# Altium project AKK_V3.PrjPcb
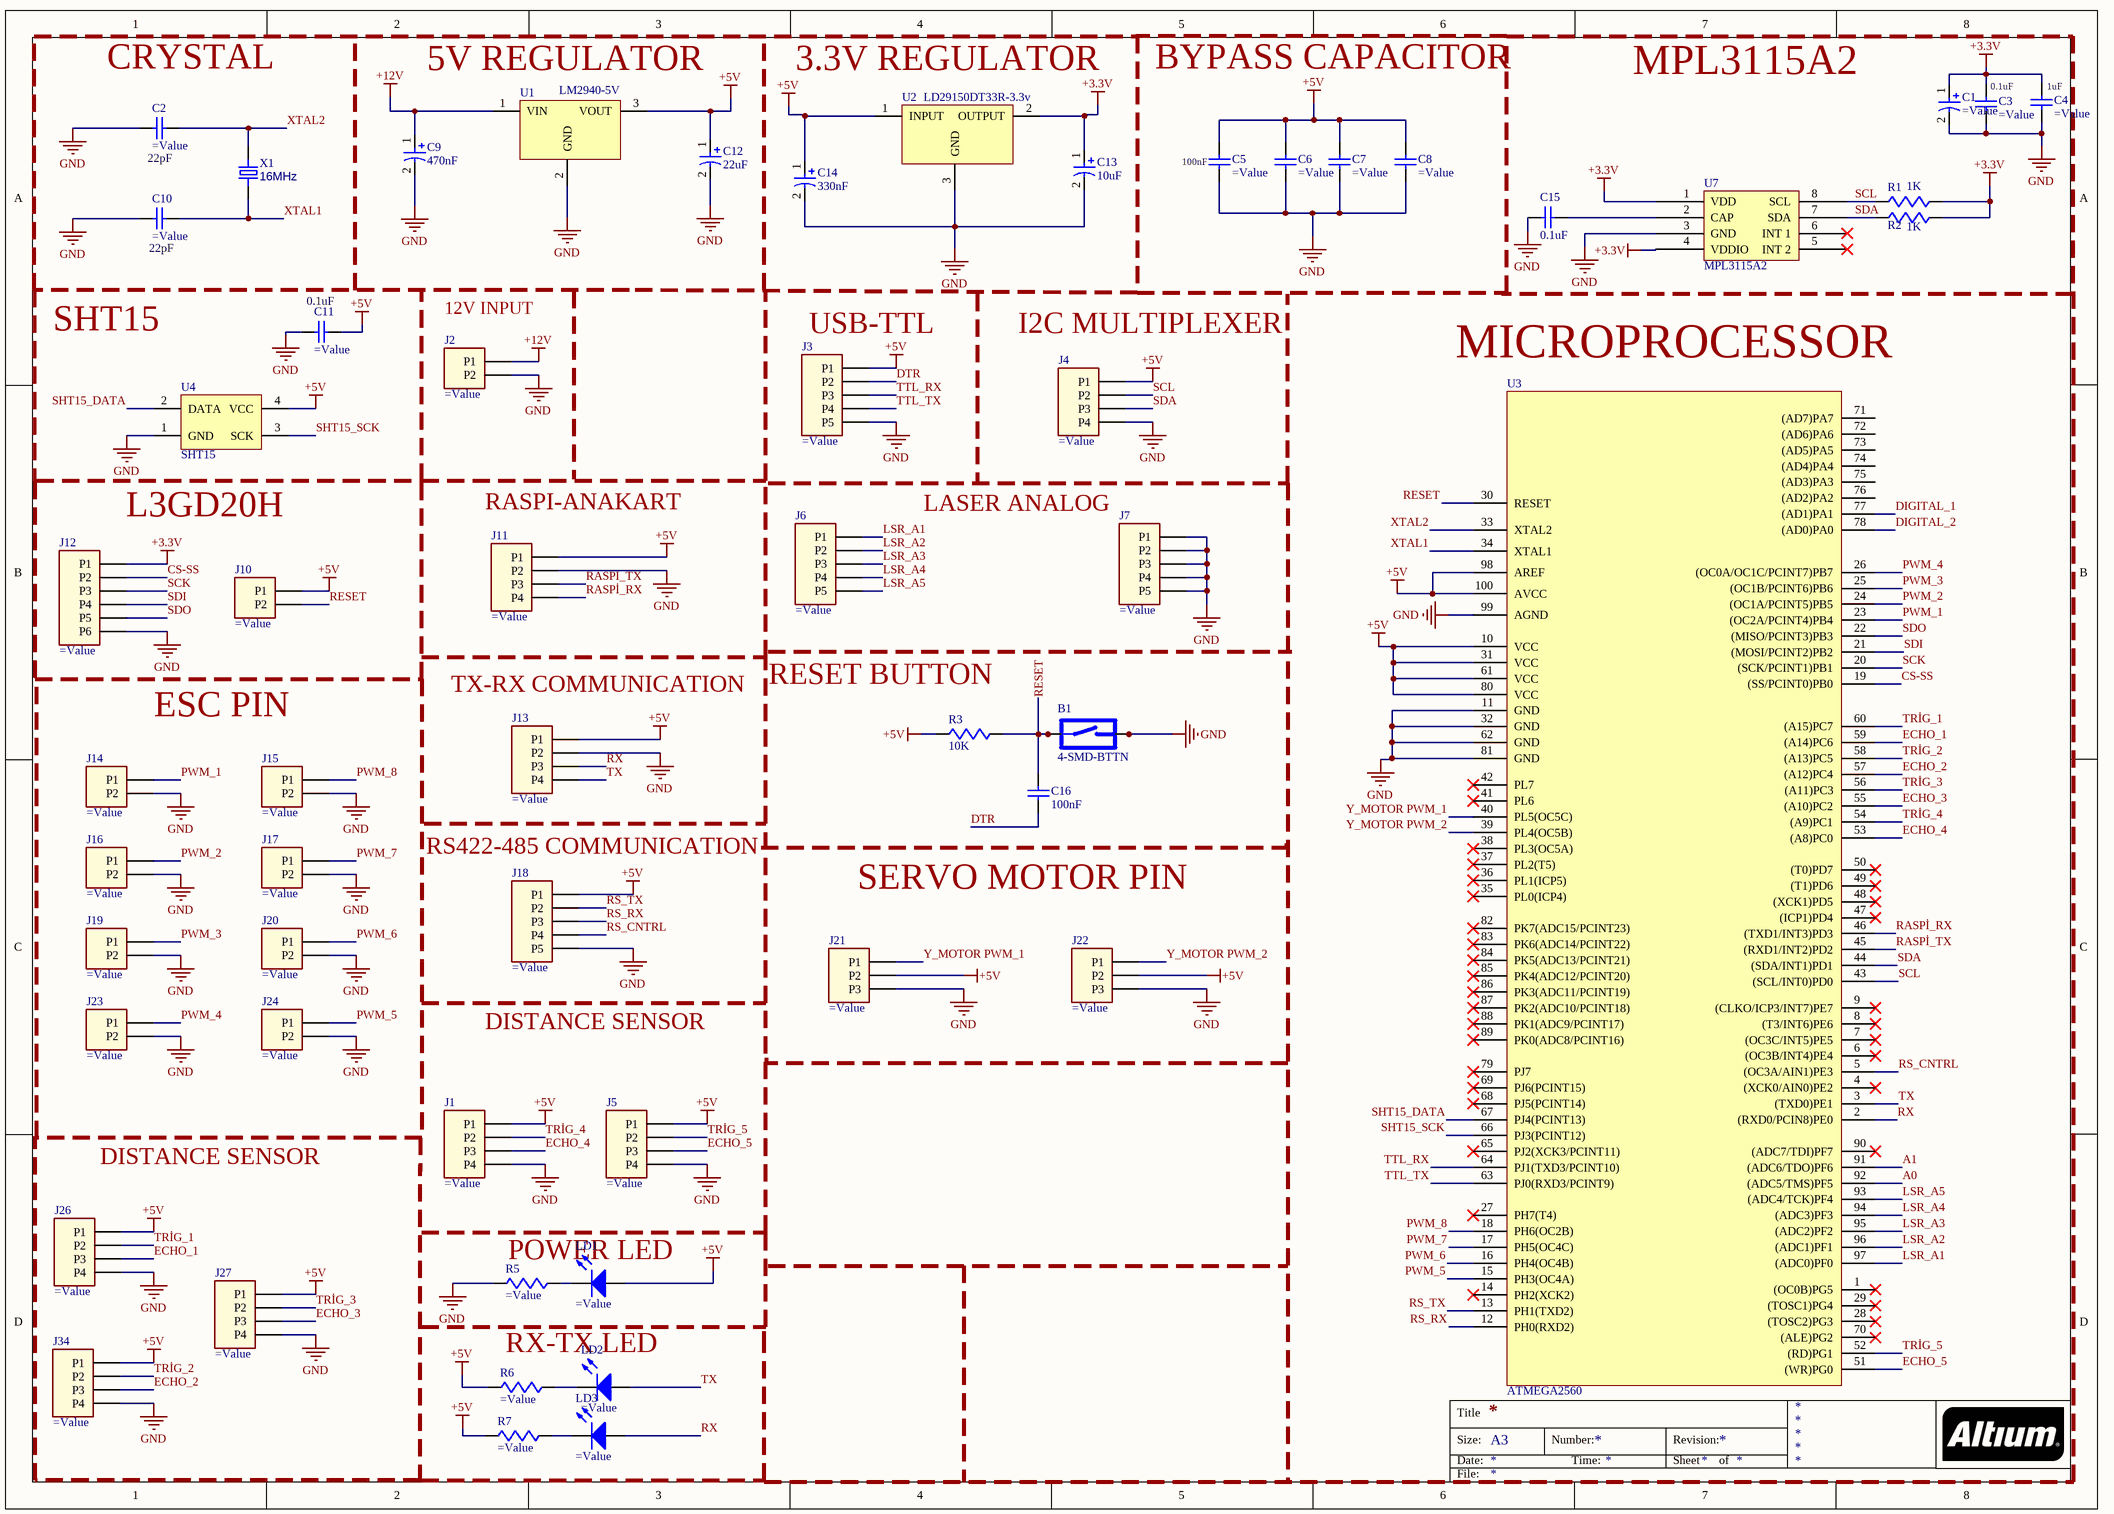
[diagram p0: AKK_V3.SchDoc]
1 sheet, 57 parts. Net scope: global (net labels, ports and power ports of the same name join across sheets).
Board file: AKK_V2.1.PcbDoc

## Sheet AKK_V3.SchDoc
size A3

### Parts
B1  4-SMD-BTTN  [4-SMD-BTTN-11.6-6.5]
C1  (no value)  [CAP_5MM]
C2  (no value)  [C1206N]
C3  (no value)  [C1206N]
C4  (no value)  [C1206N]
C5  (no value)  [C1206N]
C6  (no value)  [C1206N]
C7  (no value)  [C1206N]
C8  (no value)  [C1206N]
C9  470nF  [T_1206]
C10  (no value)  [C1206N]
C11  (no value)  [C1206N]
C12  22uF  [T_7343]
C13  10uF  [T_7343]
C14  330nF  [T_1206]
C15  0.1uF  [C1206N]
C16  100nF  [C1206N]
J1  (no value)  [4_PİN_HEADER]
J2  (no value)  [Klemens_5mm]
J3  (no value)  [5_PİN_HEADER]
J4  (no value)  [4_PİN_HEADER]
J5  (no value)  [4_PİN_HEADER]
J6  (no value)  [5_PİN_HEADER]
J7  (no value)  [5_PİN_HEADER]
J10  (no value)  [2_PİN_HEADER]
J11  (no value)  [4_PİN_HEADER]
J12  (no value)  [CONN_6_XH]
J13  (no value)  [4_PİN_HEADER]
J14  (no value)  [CONN_2_XH]
J15  (no value)  [CONN_2_XH]
J16  (no value)  [CONN_2_XH]
J17  (no value)  [CONN_2_XH]
J18  (no value)  [5_PİN_HEADER]
J19  (no value)  [CONN_2_XH]
J20  (no value)  [CONN_2_XH]
J21  (no value)  [CONN_3_XH]
J22  (no value)  [CONN_3_XH]
J23  (no value)  [CONN_2_XH]
J24  (no value)  [CONN_2_XH]
J26  (no value)  [4_PİN_HEADER]
J27  (no value)  [4_PİN_HEADER]
J34  (no value)  [4_PİN_HEADER]
LD1  (no value)  [1206-BLUE]
LD2  (no value)  [1206-BLUE]
LD3  (no value)  [1206-BLUE]
R1  1K  [R1206N]
R2  1K  [R1206N]
R3  10K  [R1206N]
R5  (no value)  [R1206N]
R6  (no value)  [R1206N]
R7  (no value)  [R1206N]
U1  LM2940-5V  [TO220]
U2  LD29150DT33R-3.3v  [TO252-DPAK]
U3  ATMEGA2560  [TQFP100-2]
U4  SHT15  [SHT15]
U7  MPL3115A2  [MPL3115A2]
X1  16MHz  [HC49]

### Nets
+3.3V: C1.1(P) C3.2 C4.2 C13.1(P) J12.1(P1) R1.2(B) R2.2(B) U2.2(OUTPUT) U7.1(VDD) U7.4(VDDIO)
+5V: C5.2 C6.2 C7.2 C8.2 C11.1 C12.1(P) C14.1(P) J1.1(P1) J3.1(P1) J4.1(P1) J5.1(P1) J10.1(P1) J11.1(P1) J13.1(P1) J18.1(P1) J21.2(P2) J22.2(P2) J26.1(P1) J27.1(P1) J34.1(P1) LD1.2(A) R3.1(A) R6.1(A) R7.1(A) U1.3(VOUT) U2.1(INPUT) U3.10(VCC) U3.31(VCC) U3.61(VCC) U3.80(VCC) U3.98(AREF) U3.100(AVCC) U4.4(VCC)
+12V: C9.1(P) J2.1(P1) U1.1(VIN)
GND: B1.1 B1.2 C1.2(N) C2.2 C3.1 C4.1 C5.1 C6.1 C7.1 C8.1 C9.2(N) C10.2 C11.2 C12.2(N) C13.2(N) C14.2(N) C15.2 J1.4(P4) J2.2(P2) J3.5(P5) J4.4(P4) J5.4(P4) J7.1(P1) J7.2(P2) J7.3(P3) J7.4(P4) J7.5(P5) J11.2(P2) J12.6(P6) J13.2(P2) J14.2(P2) J15.2(P2) J16.2(P2) J17.2(P2) J18.5(P5) J19.2(P2) J20.2(P2) J21.3(P3) J22.3(P3) J23.2(P2) J24.2(P2) J26.4(P4) J27.4(P4) J34.4(P4) R5.1(A) U1.2(GND) U2.3(GND) U3.11(GND) U3.32(GND) U3.62(GND) U3.81(GND) U3.99(AGND) U4.1(GND) U7.3(GND)
A0: U3.92((ADC5/TMS)PF5)
A1: U3.91((ADC6/TDO)PF6)
CS-SS: J12.2(P2) U3.19((SS/PCINT0)PB0)
DIGITAL_1: U3.77((AD1)PA1)
DIGITAL_2: U3.78((AD0)PA0)
DTR: C16.1 J3.2(P2)
ECHO_1: J26.3(P3) U3.59((A14)PC6)
ECHO_2: J34.3(P3) U3.57((A12)PC4)
ECHO_3: J27.3(P3) U3.55((A10)PC2)
ECHO_4: J1.3(P3) U3.53((A8)PC0)
ECHO_5: J5.3(P3) U3.51((WR)PG0)
LSR_A1: J6.1(P1) U3.97((ADC0)PF0)
LSR_A2: J6.2(P2) U3.96((ADC1)PF1)
LSR_A3: J6.3(P3) U3.95((ADC2)PF2)
LSR_A4: J6.4(P4) U3.94((ADC3)PF3)
LSR_A5: J6.5(P5) U3.93((ADC4/TCK)PF4)
PWM_1: J14.1(P1) U3.23((OC2A/PCINT4)PB4)
PWM_2: J16.1(P1) U3.24((OC1A/PCINT5)PB5)
PWM_3: J19.1(P1) U3.25((OC1B/PCINT6)PB6)
PWM_4: J23.1(P1) U3.26((OC0A/OC1C/PCINT7)PB7)
PWM_5: J24.1(P1) U3.15(PH3(OC4A))
PWM_6: J20.1(P1) U3.16(PH4(OC4B))
PWM_7: J17.1(P1) U3.17(PH5(OC4C))
PWM_8: J15.1(P1) U3.18(PH6(OC2B))
RASPİ_RX: J11.4(P4) U3.46((TXD1/INT3)PD3)
RASPİ_TX: J11.3(P3) U3.45((RXD1/INT2)PD2)
RESET: B1.3 B1.4 C16.2 J10.2(P2) R3.2(B) U3.30(RESET)
RS_CNTRL: J18.4(P4) U3.5((OC3A/AIN1)PE3)
RS_RX: J18.3(P3) U3.12(PH0(RXD2))
RS_TX: J18.2(P2) U3.13(PH1(TXD2))
RX: J13.3(P3) LD3.2(A) U3.2((RXD0/PCIN8)PE0)
SCK: J12.3(P3) U3.20((SCK/PCINT1)PB1)
SCL: J4.2(P2) R1.1(A) U3.43((SCL/INT0)PD0) U7.8(SCL)
SDA: J4.3(P3) R2.1(A) U3.44((SDA/INT1)PD1) U7.7(SDA)
SDI: J12.4(P4) U3.21((MOSI/PCINT2)PB2)
SDO: J12.5(P5) U3.22((MISO/PCINT3)PB3)
SHT15_DATA: U3.67(PJ4(PCINT13)) U4.2(DATA)
SHT15_SCK: U3.66(PJ3(PCINT12)) U4.3(SCK)
TRİG_1: J26.2(P2) U3.60((A15)PC7)
TRİG_2: J34.2(P2) U3.58((A13)PC5)
TRİG_3: J27.2(P2) U3.56((A11)PC3)
TRİG_4: J1.2(P2) U3.54((A9)PC1)
TRİG_5: J5.2(P2) U3.52((RD)PG1)
TTL_RX: J3.3(P3) U3.64(PJ1(TXD3/PCINT10))
TTL_TX: J3.4(P4) U3.63(PJ0(RXD3/PCINT9))
TX: J13.4(P4) LD2.2(A) U3.3((TXD0)PE1)
XTAL1: C10.1 U3.34(XTAL1) X1.1
XTAL2: C2.1 U3.33(XTAL2) X1.2
Y_MOTOR PWM_1: J21.1(P1) U3.40(PL5(OC5C))
Y_MOTOR PWM_2: J22.1(P1) U3.39(PL4(OC5B))
NetC15_1: C15.1 U7.2(CAP)
NetLD1_1: LD1.1(K) R5.2(B)
NetLD2_1: LD2.1(K) R6.2(B)
NetLD3_1: LD3.1(K) R7.2(B)

Not connected (* = marked no-connect by the designer): U3 1((OC0B)PG5)* 4((XCK0/AIN0)PE2)* 6((OC3B/INT4)PE4)* 7((OC3C/INT5)PE5)* 8((T3/INT6)PE6)* 9((CLKO/ICP3/INT7)PE7)* 14(PH2(XCK2))* 27(PH7(T4))* 28((TOSC2)PG3)* 29((TOSC1)PG4)* 35(PL0(ICP4))* 36(PL1(ICP5))* 37(PL2(T5))* 38(PL3(OC5A))* 41(PL6)* 42(PL7)* 47((ICP1)PD4)* 48((XCK1)PD5)* 49((T1)PD6)* 50((T0)PD7)* 65(PJ2(XCK3/PCINT11))* 68(PJ5(PCINT14))* 69(PJ6(PCINT15))* 70((ALE)PG2)* 71((AD7)PA7) 72((AD6)PA6) 73((AD5)PA5) 74((AD4)PA4) 75((AD3)PA3) 76((AD2)PA2) 79(PJ7)* 82(PK7(ADC15/PCINT23))* 83(PK6(ADC14/PCINT22))* 84(PK5(ADC13/PCINT21))* 85(PK4(ADC12/PCINT20))* 86(PK3(ADC11/PCINT19))* 87(PK2(ADC10/PCINT18))* 88(PK1(ADC9/PCINT17))* 89(PK0(ADC8/PCINT16))* 90((ADC7/TDI)PF7)*; U7 5(INT_2)* 6(INT_1)*

### Notes on the sheet
- (near C2) CRYSTAL
- (near U1) 5V REGULATOR
- (near U2) 3.3V REGULATOR
- BYPASS CAPACITOR
- MPL3115A2
- (near C3) 0.1uF
- (near C4) 1uF
- (near C2) 22pF
- (near C5) 100nF
- (near C10) 22pF
- (near C11) 0.1uF
- (near J2) 12V INPUT
- SHT15
- (near J3) USB-TTL
- (near J4) I2C MULTIPLEXER
- MICROPROCESSOR
- L3GD20H
- (near J11) RASPI-ANAKART
- LASER ANALOG
- ESC PIN
- (near J13) TX-RX COMMUNICATION
- (near R3) RESET BUTTON
- RS422-485 COMMUNICATION
- SERVO MOTOR PIN
- DISTANCE SENSOR
- POWER LED
- RX-TX LED
- Title
- Size:
- Date:
- A3
- Number:
- Time:
- Revision:
- Sheet
- of
- File:

### Library data of the parts
B1 = B3FS-1012P: SWITCH TACTILE SPST-NO 0.05A 24V; Manufacturer: Omron; Mechanical Life: 300000Cycles; Switch Travel: 0.25mm; Actuator Type: Standard; Switch Function: Off-Mom; Illumination Type: Non-Illuminated; Throw Configuration: SPST; Contact Resistance: 100mR; Operating Force: 1.47N; Current Rating: 50mA; Actuator Length: 1.7mm; Manufacturer Part Number: B3FS-1012P; Supplier 1: Avnet; Supplier Part Number 1: B3FS-1012P; RoHS: Yes; Category: Tactile Switches; Stock 1: 221000; Pricing 1: 1000=0,33775, 2000=0,33710, 4000=0,33643, 6000=0,32612, 8000=0,30625 (USD); Mount: Surface Mount; Case/Package: SMD/SMT; Weight: 0.2g; Contact Plating: Silver; Min Operating Temperature: -20°C; Max Operating Temperature: 70°C; Termination: Gull Wing; Electrical Life: 300000Cycles; Voltage Rating (DC): 24V; Packaging: Tape and Reel; Max Voltage Rating (DC): 24V; Package Quantity: 1; Max Current Rating: 50mA; Orientation: Straight; Length: 6.3mm; Depth: 8mm; Radiation Hardening: No; ComponentLink1URL: https://datasheet.ciiva.com/30089/en-b3fs-30089264.pdf?src-supplier=Onlinecomponents.com; ComponentLink1Description: https://datasheet.ciiva.com/30089/en-b3fs-30089264.pdf?src-supplier=Onlinecomponents.com; ComponentLink2URL: https://datasheet.ciiva.com/2901/1200910001-jpg-2901308.pdf?src-supplier=Digi-Key; ComponentLink2Description: https://datasheet.ciiva.com/2901/1200910001-jpg-2901308.pdf?src-supplier=Digi-Key; ComponentLink3URL: https://datasheet.ciiva.com/2901/en-b3fs-2901309.pdf?src-supplier=Digi-Key; ComponentLink3Description: https://datasheet.ciiva.com/2901/en-b3fs-2901309.pdf?src-supplier=Digi-Key; ComponentLink4URL: https://datasheet.ciiva.com/2901/en-b3fs-2901310.pdf?src-supplier=Digi-Key; ComponentLink4Description: https://datasheet.ciiva.com/2901/en-b3fs-2901310.pdf?src-supplier=Digi-Key
C1 = EEE-1CA100SR: Capacitor; Alum Electrolytic; Cap 10 uF; Tol 20%; Vol-Rtg 16 VDC; SMT; 4x5.5; Cut Tape; Manufacturer: Panasonic; Capacitance: 10uF; Voltage Rating: 16V; Dielectric Material: Aluminium; Life (Hours): 2000Hour; Polarity: Polar; Leakage Current: 3uA; Ripple Current: 28mA; Lead Length: 1.8mm; Manufacturer Part Number: EEE-1CA100SR; Supplier 1: Arrow; Supplier Part Number 1: EEE-1CA100SR; RoHS: Yes; Category: Aluminum Electrolytic Capacitors; Stock 1: 148000; Pricing 1: 2000=0,05160, 4000=0,05110, 10000=0,04690, 1=0,22540, 10=0,18810 (USD); Mount: Surface Mount,PCB; Case/Package: Radial; Number of Pins: 2; Min Operating Temperature: -40°C; Max Operating Temperature: 85°C; Packaging: Tape and Reel; Voltage Rating (DC): 16V; Package Quantity: 2000; Termination: SMD/SMT; Voltage: 16V; Length: 5.5mm; Height: 5.4mm; Width: 4.3mm; Radiation Hardening: No; Lead Free: Lead Free; REACH SVHC: No SVHC; ComponentLink1URL: https://datasheet.ciiva.com/11784/0900766b8078636e-11784608.pdf?src-supplier=RSComponents; ComponentLink1Description: https://datasheet.ciiva.com/11784/0900766b8078636e-11784608.pdf?src-supplier=RSComponents; ComponentLink2URL: https://datasheet.ciiva.com/19458/1355487-19458346.pdf?src-supplier=Jameco; ComponentLink2Description: https://datasheet.ciiva.com/19458/1355487-19458346.pdf?src-supplier=Jameco; ComponentLink3URL: https://datasheet.ciiva.com/2983/aba0000ce2-2983908.pdf?src-supplier=Avnet; ComponentLink3Description: https://datasheet.ciiva.com/2983/aba0000ce2-2983908.pdf?src-supplier=Avnet; ComponentLink4URL: https://datasheet.ciiva.com/46435/aba0000ce2-46435189.pdf?src-supplier=Element14; ComponentLink6URL: https://datasheet.ciiva.com/43485/aba0000ce2-43485607.pdf?src-supplier=Farnell; ComponentLink6Description: https://datasheet.ciiva.com/43485/aba0000ce2-43485607.pdf?src-supplier=Farnell; ComponentLink7URL: https://datasheet.ciiva.com/14603/70255710-14603768.pdf?src-supplier=Allied+Electronics; Contact Plating: Tin; Tolerance: 20%; Height - Seated (Max): 0.213inch; Ripple Current (AC): 28mA; Diameter: 4mm; Lead Pitch: 1mm; ComponentLink8URL: https://datasheet.ciiva.com/17353/aba0000ce2-17353304.pdf?src-supplier=Avnet+Europe; ComponentLink8Description: https://datasheet.ciiva.com/17353/aba0000ce2-17353304.pdf?src-supplier=Avnet+Europe; ComponentLink9URL: https://datasheet.ciiva.com/14589/70255710-14589897.pdf?src-supplier=Allied+Electronics; ComponentLink9Description: https://datasheet.ciiva.com/14589/70255710-14589897.pdf?src-supplier=Allied+Electronics
C2-C8 C10 C11 C15 = C1206C104K5RAC7210: CAP CER 0.1UF 50V X7R 1206; Manufacturer: KEMET; Capacitance: 100nF; Tolerance: 10%; Dielectric Material: Ceramic; Manufacturer Part Number: C1206C104K5RAC7210; Supplier 1: Digi-Key; Supplier Part Number 1: 399-7357-2-ND; RoHS: Yes; Category: Ceramic Capacitors; Stock 1: 70000; Pricing 1: 10000=0,01650, 20000=0,01568 (USD); Mount: Surface Mount; Case/Package: 1206; Case Code (Imperial): 1206; Case Code (Metric): 3216; Min Operating Temperature: -55°C; Max Operating Temperature: 125°C; Dielectric: X7R; Voltage Rating: 50V; Packaging: Tape and Reel; Voltage Rating (DC): 50V; Package Quantity: 10000; Termination: SMD/SMT; Length: 3.2mm; Height: 0.78mm; Width: 1.6mm; Thickness: 0.035inch; Depth: 1.6mm; Radiation Hardening: No; ComponentLink1URL: https://datasheet.ciiva.com/16623/datasheetpn-c1206c104k5rac7210-16623777.pdf?src-supplier=Avnet+Europe; ComponentLink1Description: https://datasheet.ciiva.com/16623/datasheetpn-c1206c104k5rac7210-16623777.pdf?src-supplier=Avnet+Europe; ComponentLink2URL: https://datasheet.ciiva.com/18194/getdatasheetpartid-94372-18194154.pdf?src-supplier=Verical; ComponentLink2Description: https://datasheet.ciiva.com/18194/getdatasheetpartid-94372-18194154.pdf?src-supplier=Verical
C9 C14 = TCJA106M020R0150: CAP TANT POLY 10UF 20V 1206; Manufacturer: Kyocera AVX; Tolerance: 20%; ESR (Equivalent Series Resistance): 150mR; Life (Hours): 2000Hour; Manufacturer Part Number: TCJA106M020R0150; Supplier 1: Future Electronics; Supplier Part Number 1: TCJA106M020R0150-REEL; RoHS: No; Category: Polymer Capacitors; Stock 1: 8000; Pricing 1: 2000=0,29500 (USD); Mount: Surface Mount; Case/Package: 1206; Case Code (Imperial): 1206; Case Code (Metric): 3216; Min Operating Temperature: -55°C; Max Operating Temperature: 105°C; Capacitance: 10uF; Voltage Rating: 20V; Packaging: Tape and Reel; ComponentLink1URL: http://www.farnell.com/datasheets/2708905.pdf?src-supplier=Farnell; ComponentLink1Description: http://www.farnell.com/datasheets/2708905.pdf?src-supplier=Farnell; ComponentLink2URL: http://datasheets.avx.com/TCJ.pdf?src-supplier=Digi-Key; ComponentLink2Description: http://datasheets.avx.com/TCJ.pdf?src-supplier=Digi-Key; ComponentLink3URL: http://catalogs.avx.com/TantalumNiobium.pdf?src-supplier=Digi-Key; ComponentLink3Description: http://catalogs.avx.com/TantalumNiobium.pdf?src-supplier=Digi-Key; Features: General Purpose
C12 C13 = TCJD226M035R0100: CAP TANT POLY 22UF 35V 2917; Manufacturer: Kyocera AVX; Tolerance: 20%; Resistance: 0.1R; ESR (Equivalent Series Resistance): 100mR; Manufacturer Part Number: TCJD226M035R0100; Supplier 1: Arrow; Supplier Part Number 1: TCJD226M035R0100; RoHS: Yes; Category: Tantalum Capacitors; Stock 1: 400; Pricing 1: 1=2,46600, 10=2,37000, 25=2,34600, 100=2,07700, 250=2,06700 (USD); Mount: Surface Mount; Case/Package: 2917; Case Code (Imperial): 2917; Case Code (Metric): 7343; Min Operating Temperature: -55°C; Max Operating Temperature: 125°C; Capacitance: 22uF; Voltage Rating: 35V; Packaging: Tape and Reel; Voltage Rating (DC): 35V; Package Quantity: 1; Termination: SMD/SMT; Length: 7.3mm; Height: 3.1mm; Width: 4.3mm; Depth: 4.3mm; Radiation Hardening: No; Lead Free: Lead Free; ComponentLink1URL: https://datasheet.ciiva.com/265/tcj-265476.pdf?src-supplier=Digi-Key; ComponentLink1Description: https://datasheet.ciiva.com/265/tcj-265476.pdf?src-supplier=Digi-Key; ComponentLink2URL: https://datasheet.ciiva.com/265/tcj-265477.pdf?src-supplier=Digi-Key; ComponentLink2Description: https://datasheet.ciiva.com/265/tcj-265477.pdf?src-supplier=Digi-Key; ComponentLink3URL: https://datasheet.ciiva.com/265/tcj-265478.pdf?src-supplier=Digi-Key; ComponentLink3Description: https://datasheet.ciiva.com/265/tcj-265478.pdf?src-supplier=Digi-Key; Height - Seated (Max): 0.122inch
C16 = C1206C104K5RAC7210: CAP CER 0.1UF 50V X7R 1206; Manufacturer: KEMET; Tolerance: 10%; Dielectric Material: Ceramic; Manufacturer Part Number: C1206C104K5RAC7210; Supplier 1: Digi-Key; Supplier Part Number 1: 399-7357-2-ND; RoHS: Yes; Category: Ceramic Capacitors; Stock 1: 70000; Pricing 1: 10000=0,01650, 20000=0,01568 (USD); Mount: Surface Mount; Case/Package: 1206; Case Code (Imperial): 1206; Case Code (Metric): 3216; Min Operating Temperature: -55°C; Max Operating Temperature: 125°C; Capacitance: 100nF; Dielectric: X7R; Voltage Rating: 50V; Packaging: Tape and Reel; Voltage Rating (DC): 50V; Package Quantity: 10000; Termination: SMD/SMT; Length: 3.2mm; Height: 0.78mm; Width: 1.6mm; Thickness: 0.035inch; Depth: 1.6mm; Radiation Hardening: No; ComponentLink1URL: https://datasheet.ciiva.com/16623/datasheetpn-c1206c104k5rac7210-16623777.pdf?src-supplier=Avnet+Europe; ComponentLink1Description: https://datasheet.ciiva.com/16623/datasheetpn-c1206c104k5rac7210-16623777.pdf?src-supplier=Avnet+Europe; ComponentLink2URL: https://datasheet.ciiva.com/18194/getdatasheetpartid-94372-18194154.pdf?src-supplier=Verical; ComponentLink2Description: https://datasheet.ciiva.com/18194/getdatasheetpartid-94372-18194154.pdf?src-supplier=Verical
J1 J4 J5 J11 J13 J26 J27 J34 = PPTC041LFBN-RC: CONN HDR 4POS 0.1 TIN PCB; Manufacturer: Sullins; Number of Positions: 4; Connector Type: Header,Socket; Pitch: 0.1inch; Manufacturer Part Number: PPTC041LFBN-RC; Supplier 1: Future Electronics; Supplier Part Number 1: PPTC041LFBN-RC-TRAY; RoHS: Yes; Category: Connectors; Stock 1: 13214; Pricing 1: 1=0,42500, 150=0,29500, 400=0,27500, 1500=0,24500, 4000=0,23000 (USD); Mount: Through Hole; Packaging: Bulk; Package Quantity: 1000; Termination: Solder; Length: 10.7mm; Height: 8.5mm; Width: 2.5mm; Lead Free: Lead Free; ComponentLink1URL: https://media.digikey.com/pdf/Data%20Sheets/Sullins%20PDFs/Female_Headers.100_DS.pdf?src-supplier=Digi-Key; ComponentLink1Description: https://media.digikey.com/pdf/Data%20Sheets/Sullins%20PDFs/Female_Headers.100_DS.pdf?src-supplier=Digi-Key; ComponentLink2URL: http://www.sullinscorp.com/catalogs/78_Page80-81_HEADER_.100_2.54mm_FEMALE.pdf?src-supplier=Future+Electronics; ComponentLink2Description: http://www.sullinscorp.com/catalogs/78_Page80-81_HEADER_.100_2.54mm_FEMALE.pdf?src-supplier=Future+Electronics; Contact Plating: Tin; Contact Material: Bronze; Housing Material: Plastic; Color: Black; Number of Rows: 1
J2 = OSTTH020160: Terminal Block Plug Female Socket 2 Position 5mm Screw Straight Cable Mount 15A; Manufacturer: On-Shore Technology; Manufacturer Part Number: OSTTH020160; Supplier 1: Digi-Key; Supplier Part Number 1: ED2655-ND; RoHS: Yes; Category: Terminal Blocks; Stock 1: 15120; Pricing 1: 1=0,91000, 10=0,56800, 25=0,48600, 50=0,43680, 100=0,42770, 250=0,36400, 500=0,34580, 1000=0,30940, 5000=0,24206 (USD); Mount: Free Hanging,Cable; Min Operating Temperature: -30°C; Max Operating Temperature: 105°C; Packaging: Bulk; Package Quantity: 1; Contact Material: Brass,Steel; Housing Material: Thermoplastic; Housing Color: Blue; Color: Blue; Orientation: Straight; Number of Rows: 1; Max Current Rating: 15A
J3 J6 J7 J18 = PPPC051LFBN-RC: CONN HDR 5POS 0.1 GOLD PCB; Manufacturer: Sullins; Number of Positions: 5; Connector Type: Header,Socket; Pitch: 0.1inch; Manufacturer Part Number: PPPC051LFBN-RC; Supplier 1: Future Electronics; Supplier Part Number 1: PPPC051LFBN-RC-TRAY; RoHS: Yes; Category: Connectors; Stock 1: 4112; Pricing 1: 1=0,46000, 125=0,32000, 400=0,29000, 1250=0,27000, 4000=0,24500 (USD); Mount: Through Hole; Packaging: Bulk; Package Quantity: 1000; Termination: Solder; Length: 13.2mm; Height: 8.5mm; Width: 2.5mm; Lead Free: Lead Free; ComponentLink1URL: https://media.digikey.com/pdf/Data%20Sheets/Sullins%20PDFs/Female_Headers.100_DS.pdf?src-supplier=Digi-Key; ComponentLink1Description: https://media.digikey.com/pdf/Data%20Sheets/Sullins%20PDFs/Female_Headers.100_DS.pdf?src-supplier=Digi-Key; ComponentLink2URL: http://www.sullinscorp.com/catalogs/78_Page80-81_HEADER_.100_2.54mm_FEMALE.pdf?src-supplier=Future+Electronics; ComponentLink2Description: http://www.sullinscorp.com/catalogs/78_Page80-81_HEADER_.100_2.54mm_FEMALE.pdf?src-supplier=Future+Electronics; Contact Plating: Gold; Contact Material: Bronze; Housing Material: Plastic; Color: Black; Number of Rows: 1
J10 = PPTC021LFBN-RC: CONN HDR 2POS 0.1 TIN PCB; Manufacturer: Sullins; Number of Positions: 2; Connector Type: Header,Socket; Pitch: 0.1inch; Manufacturer Part Number: PPTC021LFBN-RC; Supplier 1: Digi-Key; Supplier Part Number 1: S7000-ND; RoHS: Yes; Category: Connectors; Stock 1: 44683; Pricing 1: 1=0,32000, 10=0,30600, 100=0,21390, 500=0,18334, 1000=0,15278, 5000=0,13095, 10000=0,12610 (USD); Mount: Through Hole; Packaging: Bulk; Package Quantity: 1000; Termination: Solder; Length: 5.58mm; Height: 8.5mm; Width: 2.5mm; Lead Free: Lead Free; ComponentLink1URL: https://media.digikey.com/pdf/Data%20Sheets/Sullins%20PDFs/Female_Headers.100_DS.pdf?src-supplier=Digi-Key; Contact Plating: Tin; Contact Material: Bronze; Housing Material: Plastic; Color: Black; Number of Rows: 1
J12 = B6B-XH-A: Pin header, single-row straight 6-pin 2.5 mm Pole no. 6 XH, B6B-XH-A, JST; Current Rating: 3A; Number of Positions: 6; Connector Type: Male Pin; Contact Resistance: 10mR; Insulation Resistance: 1GR; Pitch: 0.098inch; Manufacturer Part Number: B6B-XH-A; Supplier 1: Digi-Key; Supplier Part Number 1: B6B-XH-A-ND; Manufacturer: JST; RoHS: Yes; Category: FFC / FPC; Mount: Through Hole; Packaging: Bulk; Package Quantity: 500; Termination: Press-Fit; Lead Free: Contains Lead; ComponentLink1URL: https://datasheet.ciiva.com/6905/exh-6905738.pdf?src-supplier=Digi-Key; ComponentLink1Description: https://datasheet.ciiva.com/6905/exh-6905738.pdf?src-supplier=Digi-Key; Contact Plating: Tin,Lead; Contact Material: Bronze,Tin; Housing Material: Nylon; Housing Color: Natural; Color: Natural; Orientation: Straight; Number of Rows: 1; Number of Contacts: 6; Fastening Type: Detent
J14-J17 J19 J20 J23 J24 = B2P-VH(LF)(SN): JST (JAPAN SOLDERLESS TERMINALS) - B2P-VH(LF)(SN) - Wire-To-Board Connector, Vertical, 3.96 mm, 2 Contacts, Header, VH Series, Crimp, 1 Rows; Voltage Rating: 250V; Current Rating: 10A; Number of Positions: 2; Connector Type: Header,Male Pin; Contact Resistance: 20mR; Insulation Resistance: 1GR; Pitch: 3.96mm; Gender: Male; Manufacturer Part Number: B2P-VH(LF)(SN); Supplier 1: Arrow; Supplier Part Number 1: B2P-VH (LF) (SN); Manufacturer: JST; RoHS: Yes; Category: Headers and Wire Housings; Stock 1: 135818; Pricing 1: 1=0,16550, 10=0,15820, 100=0,11000, 500=0,09150, 1000=0,07520, 5000=0,06590, 10000=0,05930 (USD); Mount: Through Hole; Number of Pins: 2; Min Operating Temperature: -25°C; Max Operating Temperature: 85°C; Packaging: Bulk; Voltage Rating (DC): 250V; Termination: Solder; Length: 7.86mm; Height: 8.5mm; Width: 14.6mm; Depth: 8.5mm; Lead Free: Lead Free; REACH SVHC: No SVHC; ComponentLink1URL: https://datasheet.ciiva.com/11752/0900766b80826546-11752094.pdf?src-supplier=RSComponents; ComponentLink1Description: https://datasheet.ciiva.com/11752/0900766b80826546-11752094.pdf?src-supplier=RSComponents; ComponentLink2URL: https://datasheet.ciiva.com/20207/523651-20207206.pdf?src-supplier=Rapid+Electronics; ComponentLink2Description: https://datasheet.ciiva.com/20207/523651-20207206.pdf?src-supplier=Rapid+Electronics; ComponentLink3URL: https://datasheet.ciiva.com/712/evh-712456.pdf?src-supplier=Digi-Key; ComponentLink3Description: https://datasheet.ciiva.com/712/evh-712456.pdf?src-supplier=Digi-Key; ComponentLink4URL: https://datasheet.ciiva.com/8052/80543-8052029.pdf?src-supplier=Element14; ComponentLink4Description: https://datasheet.ciiva.com/8052/80543-8052029.pdf?src-supplier=Element14; Contact Plating: Tin,Copper; Contact Material: Brass,Tin; Housing Material: Polyamide; Housing Color: White; Color: Natural; Orientation: Straight; Number of Rows: 1; Number of Contacts: 2; Fastening Type: Ramp; Contact Shape: Square; Insulation Material: Nylon; Insulation Color: Natural; Max Voltage Rating (AC): 250V; Max Voltage Rating (DC): 250V; Working Voltage: 250V; Max Current Rating: 10A; Voltage Rating (AC): 250V; Contact Mating Length: 0.303inch; Lead Pitch: 3.96mm; Flammability Rating: UL94 V-0
J21 J22 = 2-644861-3: 03P MTA100 SHRD HDR,W/O PEG SN; Manufacturer: TE Connectivity; Manufacturer Part Number: 2-644861-3; Supplier 1: Arrow; Supplier Part Number 1: 2-644861-3; RoHS: Yes; Category: Connectors; Stock 1: 396; Pricing 1: 1=0,49960, 10=0,41460, 100=0,35580, 500=0,30750, 1000=0,25050, 5000=0,21910, 10000=0,19960 (USD); Mount: Through Hole; Contact Plating: Tin,Matte; Contact Material: Copper Alloy; Housing Material: Polyester; Housing Color: Black; Color: Black; Contact Shape: Square
LD1-LD3 = APTR3216PBC/A: LED BLUE CLEAR 1206 SMD; Manufacturer: Kingbright; Power Rating: 75mW; Lens Color: Colorless; Test Current: 20mA; Dominant Wavelength: 470nm; Number of Elements: 1; Forward Voltage: 3.2V; Luminous Intensity: 60mcd; Viewing Angle: 120°; Reverse Voltage: 5V; Wavelength: 639nm; Manufacturer Part Number: APTR3216PBC/A; Supplier 1: Digi-Key; Supplier Part Number 1: 754-1169-1-ND; RoHS: Yes; Category: LEDs; Stock 1: 128414; Pricing 1: 1=0,59000, 10=0,45600, 100=0,29250, 500=0,25156, 1000=0,19422 (USD); Mount: Surface Mount; Case/Package: 1206; Case Code (Imperial): 1206; Case Code (Metric): 3216; Min Operating Temperature: -40°C; Max Operating Temperature: 85°C; Packaging: Tape and Reel; Package Quantity: 2000; Length: 3.2mm; Height: 1.05mm; Width: 1.6mm; Depth: 1.6mm; Radiation Hardening: No; Lead Free: Lead Free; ComponentLink1URL: https://datasheet.ciiva.com/2114/aptr3216pbc-a-2114354.pdf?src-supplier=Digi-Key; ComponentLink1Description: https://datasheet.ciiva.com/2114/aptr3216pbc-a-2114354.pdf?src-supplier=Digi-Key; ComponentLink2URL: https://datasheet.ciiva.com/4691/aptr3216pbc-a-7371-4691743.pdf?src-supplier=Mouser; ComponentLink2Description: https://datasheet.ciiva.com/4691/aptr3216pbc-a-7371-4691743.pdf?src-supplier=Mouser; ComponentLink3URL: https://datasheet.ciiva.com/2114/aptr3216pbc-a-2114355.pdf?src-supplier=Digi-Key; ComponentLink3Description: https://datasheet.ciiva.com/2114/aptr3216pbc-a-2114355.pdf?src-supplier=Digi-Key; ComponentLink4URL: https://datasheet.ciiva.com/2114/aptr3216pbc-a-2114356.pdf?src-supplier=Digi-Key; ComponentLink4Description: https://datasheet.ciiva.com/2114/aptr3216pbc-a-2114356.pdf?src-supplier=Digi-Key; ComponentLink5URL: https://datasheet.ciiva.com/15117/getdatasheetpartid-144017-15117804.pdf?src-supplier=Verical; ComponentLink5Description: https://datasheet.ciiva.com/15117/getdatasheetpartid-144017-15117804.pdf?src-supplier=Verical; ComponentLink6URL: https://datasheet.ciiva.com/12400/lite-on-ltst-c230krkt-187437-12400814.pdf?src-supplier=Mouser; ComponentLink6Description: https://datasheet.ciiva.com/12400/lite-on-ltst-c230krkt-187437-12400814.pdf?src-supplier=Mouser; ComponentLink7URL: https://datasheet.ciiva.com/16444/ltst-c230krkt-16444734.pdf?src-supplier=Future+Electronics; ComponentLink7Description: https://datasheet.ciiva.com/16444/ltst-c230krkt-16444734.pdf?src-supplier=Future+Electronics; Color: Blue; Lens Transparency: Clear; Power Dissipation: 75mW; Forward Current: 20mA; Lens Style: Clear; Illumination Color: Blue; Number of LEDs: 1; ComponentLink8URL: https://datasheet.ciiva.com/4266/dwonloadfilehandler-ashxtxtspecnods22-2000-253-ashxtxtspecnods22-2000-253-4266917.pdf?src-supplier=Arrow; ComponentLink8Description: https://datasheet.ciiva.com/4266/dwonloadfilehandler-ashxtxtspecnods22-2000-253-ashxtxtspecnods22-2000-253-4266917.pdf?src-supplier=Arrow; ComponentLink9URL: https://datasheet.ciiva.com/11774/0900766b80dc057b-11774044.pdf?src-supplier=RSComponents
R1-R3 R5-R7 = HRG3216P-1001-B-T1: RES SMD 1K OHM 0.1% 1W 1206; Manufacturer: Susumu; Temperature Coefficient: 25ppm/°C; Resistance: 1kR; Manufacturer Part Number: HRG3216P-1001-B-T1; Supplier 1: Future Electronics; Supplier Part Number 1: HRG3216P-1001-B-T1-REEL; RoHS: Yes; Category: Chip SMD Resistors; Stock 1: 1000; Pricing 1: 1000=0,55000, 2000=0,45000, 3000=0,44500, 4000=0,44000 (USD); Case/Package: 1206; Case Code (Imperial): 1206; Case Code (Metric): 3216; Min Operating Temperature: -55°C; Max Operating Temperature: 125°C; Packaging: Tape and Reel; Tolerance: 0.1%; Composition: Thin Film; Max Power Dissipation: 1W; Number of Terminations: 2
U1 = LM2940T-5.0/NOPB: TEXAS INSTRUMENTS         LM2940T-5.0/NOPB            Fixed LDO Voltage Regulator, 0V to 26V, 500mV Dropout, 5Vout, 1Aout, TO-220-3; Manufacturer: TI National Semiconductor; Output Voltage: 5V; Number of Outputs: 1; Min Input Voltage: 6.25V; Quiescent Current: 15mA; Polarity: Positive; Output Current: 1A; Manufacturer Part Number: LM2940T-5.0/NOPB; Supplier 1: Mouser; Supplier Part Number 1: 926-LM2940T-5.0/NOPB; RoHS: Yes; Category: Voltage Regulators - Linear; Stock 1: 4213; Pricing 1: 1=1,40000, 10=1,19000, 100=0,95400, 250=0,83200, 500=0,80800, 1000=0,64200, 2500=0,61800, 1=1,56000, 10=1,32000, 100=1,06000, 250=0,92400, 500=0,89800, 1000=0,71300 (EUR); Mount: Through Hole; Case/Package: TO-220; Number of Pins: 3; Weight: 0.01lb; Contact Plating: Tin,Matte; Min Operating Temperature: -40°C; Max Operating Temperature: 125°C; Max Input Voltage: 26V; Output Type: Fixed; Dropout Voltage: 500mV; Packaging: Rail/Tube; Package Quantity: 45; Max Output Current: 1A; Nominal Output Voltage: 5V; Voltage: 5V; Length: 10.16mm; Height: 8.89mm; Width: 4.7mm; Radiation Hardening: No; Lead Free: Lead Free; REACH SVHC: No SVHC; ComponentLink1URL: https://datasheet.ciiva.com/19477/837505-19477731.pdf?src-supplier=Jameco; ComponentLink1Description: https://datasheet.ciiva.com/19477/837505-19477731.pdf?src-supplier=Jameco; ComponentLink2URL: https://datasheet.ciiva.com/15111/getdatasheetpartid-97895-15111678.pdf?src-supplier=Verical; ComponentLink2Description: https://datasheet.ciiva.com/15111/getdatasheetpartid-97895-15111678.pdf?src-supplier=Verical; ComponentLink3URL: https://datasheet.ciiva.com/41458/001014007-da-01-en-ic-reg-ldo-lm2940t-5-0-nopb-to-220-3-tid-41458133.pdf?src-supplier=Conrad; ComponentLink3Description: https://datasheet.ciiva.com/41458/001014007-da-01-en-ic-reg-ldo-lm2940t-5-0-nopb-to-220-3-tid-41458133.pdf?src-supplier=Conrad; ComponentLink4URL: https://datasheet.ciiva.com/1511/1882643-1511796.pdf?src-supplier=Element14; ComponentLink4Description: https://datasheet.ciiva.com/1511/1882643-1511796.pdf?src-supplier=Element14; ComponentLink5URL: https://datasheet.ciiva.com/6595/lm2940-n-6595369.pdf?src-supplier=Digi-Key; ComponentLink5Description: https://datasheet.ciiva.com/6595/lm2940-n-6595369.pdf?src-supplier=Digi-Key; ComponentLink6URL: https://datasheet.ciiva.com/16466/lm2940c-16466841.pdf?src-supplier=Avnet+Asia; ComponentLink6Description: https://datasheet.ciiva.com/16466/lm2940c-16466841.pdf?src-supplier=Avnet+Asia; ComponentLink7URL: https://datasheet.ciiva.com/3223/lm2940c-3223630.pdf?src-supplier=Avnet; ComponentLink7Description: https://datasheet.ciiva.com/3223/lm2940c-3223630.pdf?src-supplier=Avnet
U2 = LD29150DT33R: STMICROELECTRONICS         LD29150DT33R             Fixed LDO Voltage Regulator, 4.3V to 30V, 400mV Dropout, 3.3Vout, 1.5Aout, TO-252-3; Output Voltage: 3.3V; Number of Outputs: 1; Quiescent Current: 15mA; Polarity: Positive; Output Current: 1.5A; Accuracy: 1%; Reference Voltage: 1.2423V; Max Output Voltage: 3.333V; Manufacturer Part Number: LD29150DT33R; Supplier 1: Mouser; Supplier Part Number 1: 511-LD29150DT33R; Manufacturer: STMicroelectronics; RoHS: Yes; Category: Voltage Regulators - Linear; Stock 1: 10287; Pricing 1: 1=1,46000, 10=1,24000, 100=0,84200, 500=0,79700, 1000=0,62000, 2500=0,58900 (USD); Mount: Surface Mount; Case/Package: TO-252; Number of Pins: 3; Weight: 0.01lb; Contact Plating: Tin,Matte; Min Operating Temperature: -40°C; Max Operating Temperature: 125°C; Min Input Voltage: 4.3V; Max Input Voltage: 30V; Output Type: Fixed; Dropout Voltage: 400mV; Packaging: Tape and Reel; Package Quantity: 1; Max Output Current: 1.5A; Nominal Output Voltage: 3.3V; Length: 6.6mm; Height: 2.4mm; Width: 6.2mm; Radiation Hardening: No; Lead Free: Lead Free; REACH SVHC: No SVHC; ComponentLink1URL: https://datasheet.ciiva.com/1569/1788499-1569956.pdf?src-supplier=Farnell; ComponentLink1Description: https://datasheet.ciiva.com/1569/1788499-1569956.pdf?src-supplier=Farnell; ComponentLink2URL: https://datasheet.ciiva.com/41440/001184976-da-01-en-ic-reg-ldo-3-3-ld29150dt33r-to-252-3-stm-41440118.pdf?src-supplier=Conrad; ComponentLink2Description: https://datasheet.ciiva.com/41440/001184976-da-01-en-ic-reg-ldo-3-3-ld29150dt33r-to-252-3-stm-41440118.pdf?src-supplier=Conrad; ComponentLink3URL: https://datasheet.ciiva.com/26904/ld29150dt33r-26904424.pdf?src-supplier=IIIC; ComponentLink3Description: https://datasheet.ciiva.com/26904/ld29150dt33r-26904424.pdf?src-supplier=IIIC; ComponentLink4URL: https://datasheet.ciiva.com/2044/cd00003403-2044032.pdf?src-supplier=Digi-Key; ComponentLink4Description: https://datasheet.ciiva.com/2044/cd00003403-2044032.pdf?src-supplier=Digi-Key; ComponentLink5URL: https://datasheet.ciiva.com/2044/cd00003403-2044033.pdf?src-supplier=Digi-Key; ComponentLink5Description: https://datasheet.ciiva.com/2044/cd00003403-2044033.pdf?src-supplier=Digi-Key; ComponentLink6URL: https://datasheet.ciiva.com/22694/1904189-22694855.pdf?src-supplier=Element14; ComponentLink6Description: https://datasheet.ciiva.com/22694/1904189-22694855.pdf?src-supplier=Element14; ComponentLink7URL: https://datasheet.ciiva.com/2044/cd00003403-2044031.pdf?src-supplier=Digi-Key; ComponentLink7Description: https://datasheet.ciiva.com/2044/cd00003403-2044031.pdf?src-supplier=Digi-Key; Max Supply Voltage: 30V; Min Supply Voltage: 4.3V; Output Voltage Accuracy: 1%; Number of Regulators: 1; Input Bias Current: 15mA; Min Output Voltage: 3.3V; Termination: SMD/SMT
U3 = ATMEGA2560-16AU: Manufacturer Part Number: ATMEGA2560-16AU; Radiation Hardening: No; Lead Free: Lead Free; REACH SVHC: No SVHC; ComponentLink1URL: https://datasheet.ciiva.com/15122/getdatasheetpartid-134542-15122545.pdf?src-supplier=Verical; ComponentLink1Description: https://datasheet.ciiva.com/15122/getdatasheetpartid-134542-15122545.pdf?src-supplier=Verical; ComponentLink2URL: https://datasheet.ciiva.com/22651/1698622-22651116.pdf?src-supplier=Farnell; ComponentLink2Description: https://datasheet.ciiva.com/22651/1698622-22651116.pdf?src-supplier=Farnell; ComponentLink3URL: https://datasheet.ciiva.com/26815/atmega2560-16au-26815441.pdf?src-supplier=IIIC; ComponentLink4URL: https://datasheet.ciiva.com/29119/154804-da-01-en-atmega2560-16au-tqfp-100-29119580.pdf?src-supplier=Conrad; ComponentLink4Description: https://datasheet.ciiva.com/29119/154804-da-01-en-atmega2560-16au-tqfp-100-29119580.pdf?src-supplier=Conrad; ComponentLink5URL: https://datasheet.ciiva.com/1157/1817551-1157521.pdf?src-supplier=Element14; ComponentLink5Description: https://datasheet.ciiva.com/1157/1817551-1157521.pdf?src-supplier=Element14; ComponentLink6URL: https://datasheet.ciiva.com/6640/atmel-2549-8-bit-avr-microcontroller-atmega640-1280-1281-2560-2561-summary-6640293.pdf?src-supplier=Digi-Key; ComponentLink6Description: https://datasheet.ciiva.com/6640/atmel-2549-8-bit-avr-microcontroller-atmega640-1280-1281-2560-2561-summary-6640293.pdf?src-supplier=Digi-Key; ComponentLink7URL: https://datasheet.ciiva.com/1162/33246-1162139.pdf?src-supplier=Farnell; ComponentLink7Description: https://datasheet.ciiva.com/1162/33246-1162139.pdf?src-supplier=Farnell; ComponentLink8URL: https://datasheet.ciiva.com/16936/70123980-16936268.pdf?src-supplier=Allied+Electronics; ComponentLink8Description: https://datasheet.ciiva.com/16936/70123980-16936268.pdf?src-supplier=Allied+Electronics
U4 = SHT15: SENSIRION - SHT15 - SENSOR, HUMIDITY & TEMP, 3.3V; Output Type: Digital; Max Supply Voltage: 5.5V; Accuracy: 2%; Nominal Supply Current: 28uA; Min Supply Voltage: 2.4V; Response Time: 8s; Interface: Serial; Resolution: 14b; Sensor Type: Temperature; Sensing Method: Capacitive; Manufacturer Part Number: SHT15; Supplier 1: Digi-Key; Supplier Part Number 1: 1649-1054-1-ND; Manufacturer: Sensirion; RoHS: Yes; Category: Temperature and Humidity Sensors; Stock 1: 24799; Pricing 1: 1=27,30000, 10=16,63200 (USD); Case/Package: LCC; Number of Pins: 8; Min Operating Temperature: -40°C; Max Operating Temperature: 123.8°C; Operating Supply Voltage: 3.3V; Packaging: Cut Tape; Length: 7.42mm; Height: 2.5mm; Width: 4.88mm; REACH SVHC: No SVHC; ComponentLink1URL: https://datasheet.ciiva.com/16986/0900766b80d2f542-16986859.pdf?src-supplier=Allied+Electronics; ComponentLink1Description: https://datasheet.ciiva.com/16986/0900766b80d2f542-16986859.pdf?src-supplier=Allied+Electronics; ComponentLink2URL: https://datasheet.ciiva.com/1293/sensirion-humidity-sht1x-datasheet-v5-1293459.pdf?src-supplier=Farnell; ComponentLink2Description: https://datasheet.ciiva.com/1293/sensirion-humidity-sht1x-datasheet-v5-1293459.pdf?src-supplier=Farnell; ComponentLink3URL: https://datasheet.ciiva.com/1313/1563786-1313179.pdf?src-supplier=Element14; ComponentLink3Description: https://datasheet.ciiva.com/1313/1563786-1313179.pdf?src-supplier=Element14; ComponentLink4URL: https://datasheet.ciiva.com/28366/1563786-28366203.pdf?src-supplier=Element14; ComponentLink4Description: https://datasheet.ciiva.com/28366/1563786-28366203.pdf?src-supplier=Element14; Mount: Surface Mount; Min Supply Voltage (DC): 2.4V; Max Supply Voltage (DC): 5.5V; Lead Pitch: 1.27mm; Lead Free: Lead Free
X1 = FC4SDCBMF25.0-T1: Crystal 25MHz ±30ppm (Tol) ±50ppm (Stability) 20pF 2-Pin HC-49/SDLF SMD T/R; Manufacturer: Fox Electronics; Manufacturer Part Number: FC4SDCBMF25.0-T1; Supplier 1: Future Electronics; Supplier Part Number 1: FC4SDCBMF25.0-T1-CUTT; RoHS: No; Stock 1: 9000; Pricing 1: 1=0,28000, 50=0,21500, 100=0,20500, 250=0,19000, 500=0,18100 (USD); ComponentLink1URL: http://www.foxonline.com/pdfs/C4SD.pdf?src-supplier=Digi-Key; ComponentLink1Description: http://www.foxonline.com/pdfs/C4SD.pdf?src-supplier=Digi-Key